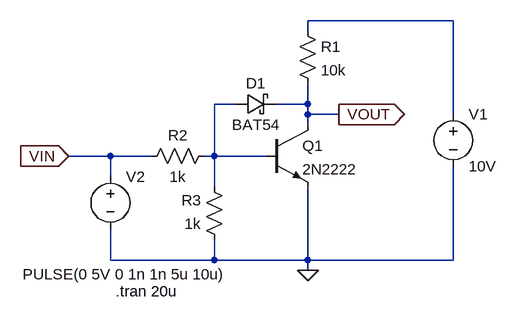
[diagram p0: schematic 2N2222_test.asc]
2N2222_test.asc, the LTspice schematic file:
Version 4
SHEET 1 880 680
WIRE 240 16 16 16
WIRE 16 32 16 16
WIRE -96 144 -128 144
WIRE 16 144 16 112
WIRE 16 144 -32 144
WIRE 16 160 16 144
WIRE 64 160 16 160
WIRE 240 160 240 16
WIRE 16 176 16 160
WIRE -288 224 -352 224
WIRE -224 224 -288 224
WIRE -128 224 -128 144
WIRE -128 224 -144 224
WIRE -48 224 -128 224
WIRE -288 256 -288 224
WIRE -128 272 -128 224
WIRE -288 384 -288 336
WIRE -128 384 -128 352
WIRE -128 384 -288 384
WIRE 16 384 16 272
WIRE 16 384 -128 384
WIRE 240 384 240 240
WIRE 240 384 16 384
WIRE 16 400 16 384
FLAG 16 400 0
FLAG -352 224 VIN
IOPIN -352 224 In
FLAG 64 160 VOUT
IOPIN 64 160 Out
SYMBOL res 0 16 R0
SYMATTR InstName R1
SYMATTR Value 10k
SYMBOL voltage 240 144 R0
WINDOW 123 0 0 Left 0
WINDOW 39 0 0 Left 0
SYMATTR InstName V1
SYMATTR Value 10V
SYMBOL voltage -288 240 R0
WINDOW 123 0 0 Left 0
WINDOW 39 0 0 Left 0
WINDOW 3 -135 166 Left 0
SYMATTR Value PULSE(0 5V 0 1n 1n 5u 10u)
SYMATTR InstName V2
SYMBOL npn -48 176 R0
SYMATTR InstName Q1
SYMATTR Value 2N2222
SYMBOL res -128 208 R90
WINDOW 0 0 56 VBottom 0
WINDOW 3 32 56 VTop 0
SYMATTR InstName R2
SYMATTR Value 1k
SYMBOL res -112 368 R180
WINDOW 0 36 76 Left 0
WINDOW 3 36 40 Left 0
SYMATTR InstName R3
SYMATTR Value 1k
SYMBOL schottky -96 160 R270
WINDOW 0 32 32 VTop 0
WINDOW 3 0 32 VBottom 0
SYMATTR InstName D1
SYMATTR Value BAT54
SYMATTR Description Diode
SYMATTR Type diode
TEXT -280 432 Left 0 !.tran 20u

The netlist it stands for:
* 2N2222_test.asc
R1 N001 VOUT 10k
V1 N001 0 10V
V2 VIN 0 PULSE(0 5V 0 1n 1n 5u 10u)
Q1 VOUT N002 0 0 2N2222
R2 N002 VIN 1k
R3 0 N002 1k
D1 N002 VOUT BAT54
.model D D
.lib standard.dio
.model NPN NPN
.model PNP PNP
.lib standard.bjt
.tran 20u
.backanno
.end